# Altium schematic sheet [08] - CONNECTORS.SchDoc: Project
size A4; Organization: Tor Brodtkorb; Address1: Frode Rinnans veg 193; Address2: 7050 Trondheim; DocumentNumber: 6598; Revision: 1.0; SheetNumber: 1; SheetTotal: 1
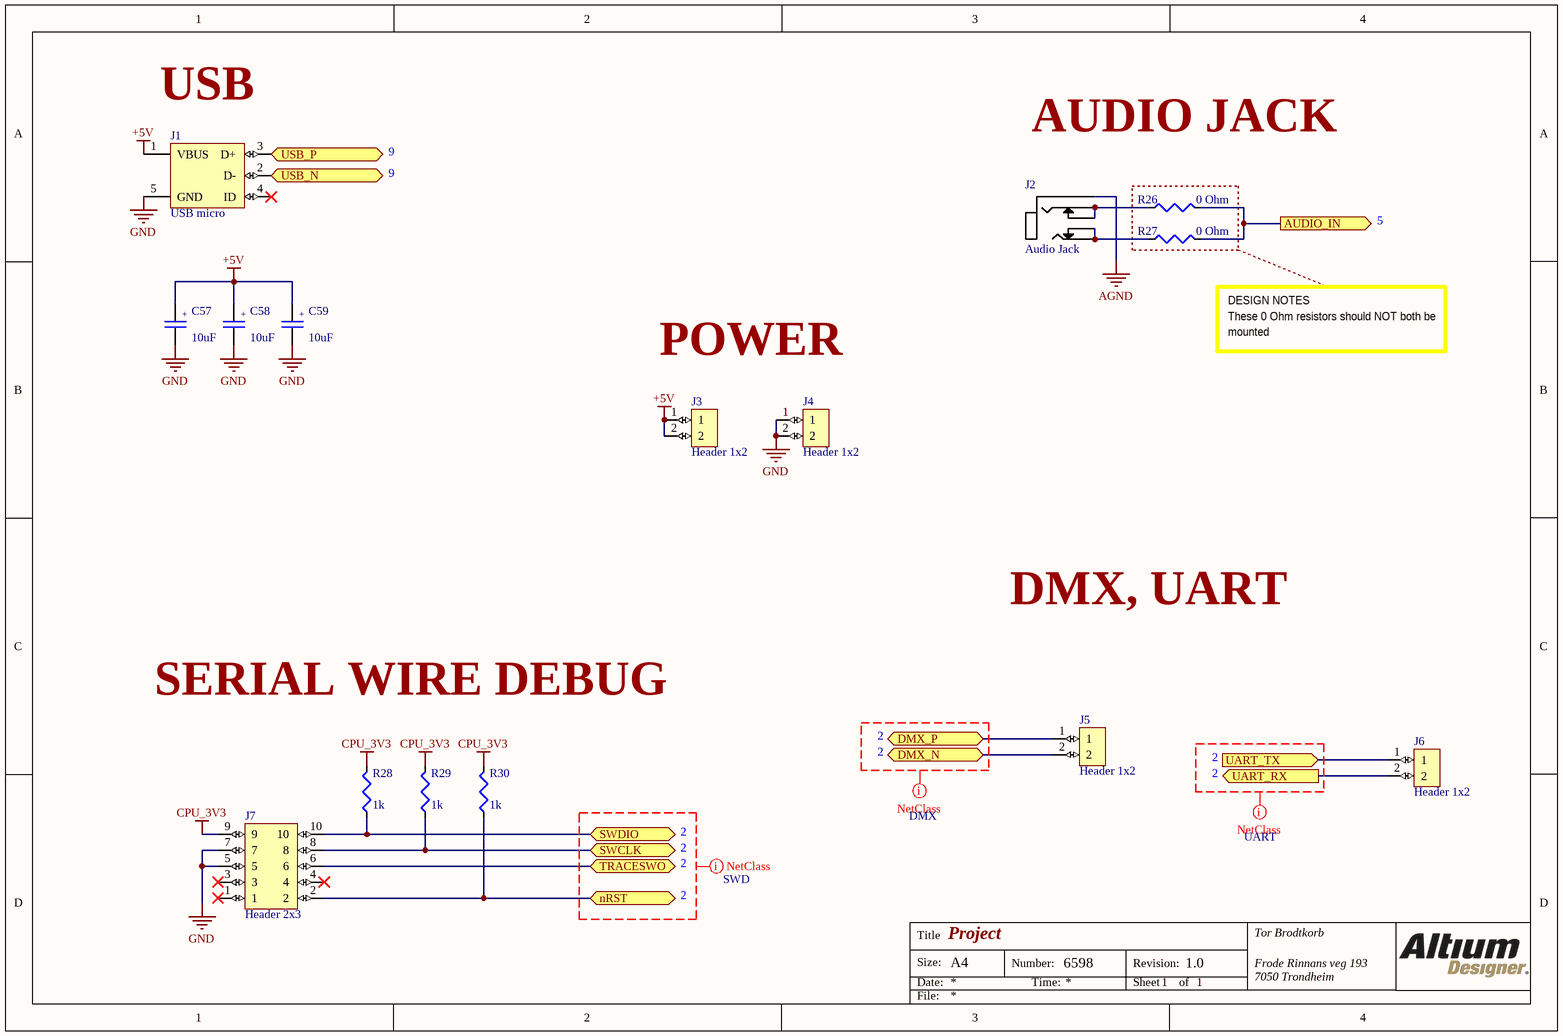
[diagram p0: [08] - CONNECTORS.SchDoc]

## Parts
C57  value 10uF  [Capacitor electrolytic SMD 4x5.4]  (hidden comment: EEE1HA2R2SR)
C58  value 10uF  [Capacitor electrolytic SMD 4x5.4]  (hidden comment: EEE1HA2R2SR)
C59  value 10uF  [Capacitor electrolytic SMD 4x5.4]  (hidden comment: EEE1HA2R2SR)
J1  USB micro  [USB micro]
J2  Audio Jack  [Audio jack flat]
J3  Header 1x2  [Header 1x2 2.54mm]
J4  Header 1x2  [Header 1x2 2.54mm]
J5  Header 1x2  [Header 1x2 2.54mm]
J6  Header 1x2  [Header 1x2 2.54mm]
J7  Header 2x3  [Header 2x5 1.27mm]
R26  value 0 Ohm  [R0603]  (hidden comment: CPF-A-0603B100KE1)
R27  value 0 Ohm  [R0603]  (hidden comment: CPF-A-0603B100KE1)
R28  value 1k  [R0603]  (hidden comment: CPF-A-0603B100KE1)
R29  value 1k  [R0603]  (hidden comment: CPF-A-0603B100KE1)
R30  value 1k  [R0603]  (hidden comment: CPF-A-0603B100KE1)

## Ports
AUDIO_IN (out), DMX_N (bidir), DMX_P (bidir), nRST (bidir), SWCLK (bidir), SWDIO (bidir), TRACESWO (bidir), UART_RX (out), UART_TX (in), USB_N (bidir), USB_P (bidir)

## Nets
+5V: C57.1 C58.1 C59.1 J1.1(VBUS) J3.1 J3.2
AGND: J2.1
CPU_3V3: J7.9 R28.2 R29.2 R30.2
GND: C57.2 C58.2 C59.2 J1.5(GND) J4.1 J4.2 J7.5 J7.7
AUDIO_IN: R26.2 R27.2 ; port AUDIO_IN
DMX_N: J5.2 ; port DMX_N
DMX_P: J5.1 ; port DMX_P
nRST: J7.2 R30.1 ; port nRST
SWCLK: J7.8 R29.1 ; port SWCLK
SWDIO: J7.10 R28.1 ; port SWDIO
TRACESWO: J7.6 ; port TRACESWO
UART_RX: J6.2 ; port UART_RX
UART_TX: J6.1 ; port UART_TX
USB_N: J1.2(D-) ; port USB_N
USB_P: J1.3(D+) ; port USB_P
NetJ2_2: J2.2 J2.3 R26.1
NetJ2_4: J2.4 J2.5 R27.1

Not connected (* = marked no-connect by the designer): J1 4(ID)*; J7 1* 3* 4*

## Layout directives
net class UART: (no net found under the mark)
net class DMX: (no net found under the mark)
net class SWD: (no net found under the mark)

## Notes on the sheet
- (near J1) USB
- 9
- AUDIO JACK
- 5
- DESIGN NOTES
- POWER
- These 0 Ohm resistors should NOT both be
- mounted
- DMX, UART
- SERIAL WIRE DEBUG
- 2
- Title
- Size:
- Date:
- A4
- Number:
- Time:
- Revision:
- Sheet
- of
- File:
- (in symbol EEE1HA2R2SR) +

## Library data of the parts
C57-C59 = EEE1HA2R2SR: El. Capacitor SMD 4x5.4
J1 = 47590-0001
J2 = FC68133: Audio jack flat 5 contacts
J3-J6 = M20-9990246: Header 1x2 2.54mm male
J7 = 20021111-00010T4LF: Header  2x5 1.27mm male
R26-R30 = CPF-A-0603B100KE1: R0603